# EAGLE design schalterbox_02 (EAGLE 5.12)
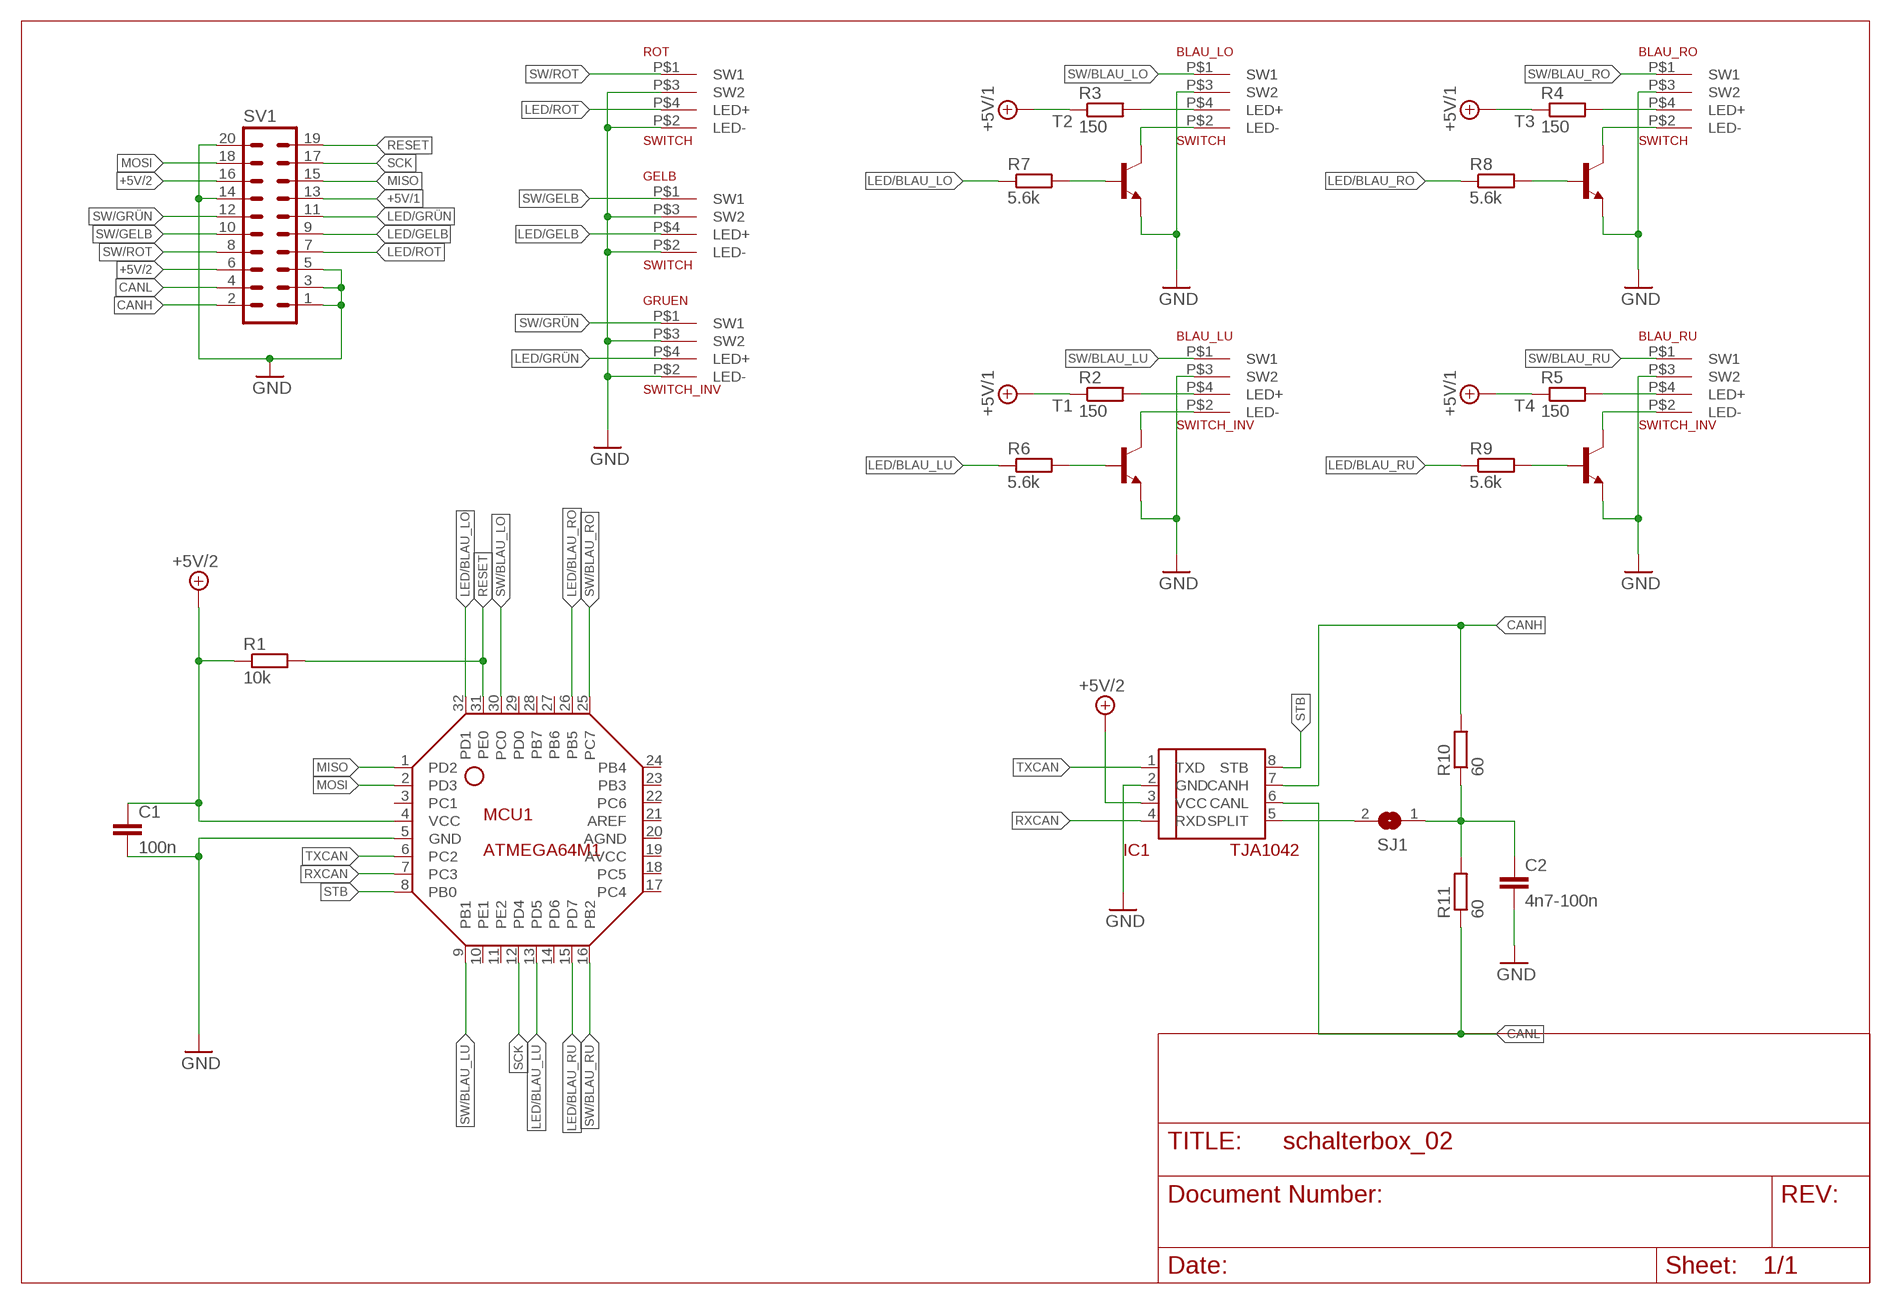
[diagram p0: schematic, sheet 1]

## Parts
BLAU_LO  SWITCH  [SWITCH]
BLAU_LU  SWITCH_INV  [SWITCH_INV]
BLAU_RO  SWITCH  [SWITCH]
BLAU_RU  SWITCH_INV  [SWITCH_INV]
C1  100n  C-EUC0603  [C0603]
C2  4n7-100n  C-EUC0603  [C0603]
GELB  SWITCH  [SWITCH]
GRUEN  SWITCH_INV  [SWITCH_INV]
IC1  TJA1042  [SO08]
MCU1  ATMEGA64M1  [TQFP-32]
R1  10k  R-EU_R0805  [R0805]
R2  150  R-EU_R0805  [R0805]
R3  150  R-EU_R0805  [R0805]
R4  150  R-EU_R0805  [R0805]
R5  150  R-EU_R0805  [R0805]
R6  5.6k  R-EU_R0805  [R0805]
R7  5.6k  R-EU_R0805  [R0805]
R8  5.6k  R-EU_R0805  [R0805]
R9  5.6k  R-EU_R0805  [R0805]
R10  60  R-EU_R0805  [R0805]
R11  60  R-EU_R0805  [R0805]
ROT  SWITCH  [SWITCH]
SJ1  SJ  [SJ]
SV1  ML20L  [ML20L]
T1  BC817-40-NPN-SOT23-BEC  [SOT23-BEC]
T2  BC817-40-NPN-SOT23-BEC  [SOT23-BEC]
T3  BC817-40-NPN-SOT23-BEC  [SOT23-BEC]
T4  BC817-40-NPN-SOT23-BEC  [SOT23-BEC]

## Nets
+5V/1: R2.1 R3.1 R4.1 R5.1 SV1.13
+5V/2: C1.1 IC1.3(VCC) MCU1.4(VCC) R1.1 SV1.6 SV1.16
CANH: IC1.7(CANH) R10.2 SV1.2
CANL: IC1.6(CANL) R11.1 SV1.4
GND: BLAU_LO.P$3(SW2) BLAU_LU.P$3(SW2) BLAU_RO.P$3(SW2) BLAU_RU.P$3(SW2) C1.2 C2.2 GELB.P$2(LED-) GELB.P$3(SW2) GRUEN.P$2(LED-) GRUEN.P$3(SW2) IC1.2(GND) MCU1.5(GND) ROT.P$2(LED-) ROT.P$3(SW2) SV1.1 SV1.3 SV1.5 SV1.14 SV1.20 T1.E T2.E T3.E T4.E
LED/BLAU_LO: MCU1.32(PD1) R7.1
LED/BLAU_LU: MCU1.13(PD5) R6.1
LED/BLAU_RO: MCU1.26(PB5) R8.1
LED/BLAU_RU: MCU1.15(PD7) R9.1
LED/GELB: GELB.P$4(LED+) SV1.9
LED/GRÜN: GRUEN.P$4(LED+) SV1.11
LED/ROT: ROT.P$4(LED+) SV1.7
MISO: MCU1.1(PD2) SV1.15
MOSI: MCU1.2(PD3) SV1.18
N$1: C2.1 R10.1 R11.2 SJ1.1
N$2: IC1.5(SPLIT) SJ1.2
N$3: BLAU_LO.P$4(LED+) R3.2
N$4: BLAU_LO.P$2(LED-) T2.C
N$7: BLAU_LU.P$4(LED+) R2.2
N$8: BLAU_LU.P$2(LED-) T1.C
N$11: BLAU_RU.P$4(LED+) R5.2
N$13: BLAU_RU.P$2(LED-) T4.C
N$17: BLAU_RO.P$4(LED+) R4.2
N$18: BLAU_RO.P$2(LED-) T3.C
N$22: R6.2 T1.B
N$23: R9.2 T4.B
N$24: R8.2 T3.B
N$25: R7.2 T2.B
RESET: MCU1.31(PE0) R1.2 SV1.19
RXCAN: IC1.4(RXD) MCU1.7(PC3)
SCK: MCU1.12(PD4) SV1.17
STB: IC1.8(STB) MCU1.8(PB0)
SW/BLAU_LO: BLAU_LO.P$1(SW1) MCU1.30(PC0)
SW/BLAU_LU: BLAU_LU.P$1(SW1) MCU1.9(PB1)
SW/BLAU_RO: BLAU_RO.P$1(SW1) MCU1.25(PC7)
SW/BLAU_RU: BLAU_RU.P$1(SW1) MCU1.16(PB2)
SW/GELB: GELB.P$1(SW1) SV1.10
SW/GRÜN: GRUEN.P$1(SW1) SV1.12
SW/ROT: ROT.P$1(SW1) SV1.8
TXCAN: IC1.1(TXD) MCU1.6(PC2)
Unconnected: MCU1.3(PC1) MCU1.10(PE1) MCU1.11(PE2) MCU1.14(PD6) MCU1.17(PC4) MCU1.18(PC5) MCU1.19(AVCC) MCU1.20(AGND) MCU1.21(AREF) MCU1.22(PC6) MCU1.23(PB3) MCU1.24(PB4) MCU1.27(PB6) MCU1.28(PB7) MCU1.29(PD0)

## Library data of the parts
BLAU_LO BLAU_RO GELB ROT = ownParts:SWITCH
BLAU_LU BLAU_RU GRUEN = ownParts:SWITCH_INV
C1 C2 = rcl:C-EU: CAPACITOR, European symbol
IC1 = ownParts:TJA1042
MCU1 = ownParts:ATMEGA64M1
R1-R11 = resistor:R-EU_: RESISTOR, European symbol
SJ1 = jumper:SJ: SMD solder JUMPER
SV1 = con-ml:ML20L: HARTING; OC_FARNELL: unknown; OC_NEWARK: unknown
T1-T4 = transistor:*-NPN-: NPN Transistror BF959 corrected 2008.03.06

## Board
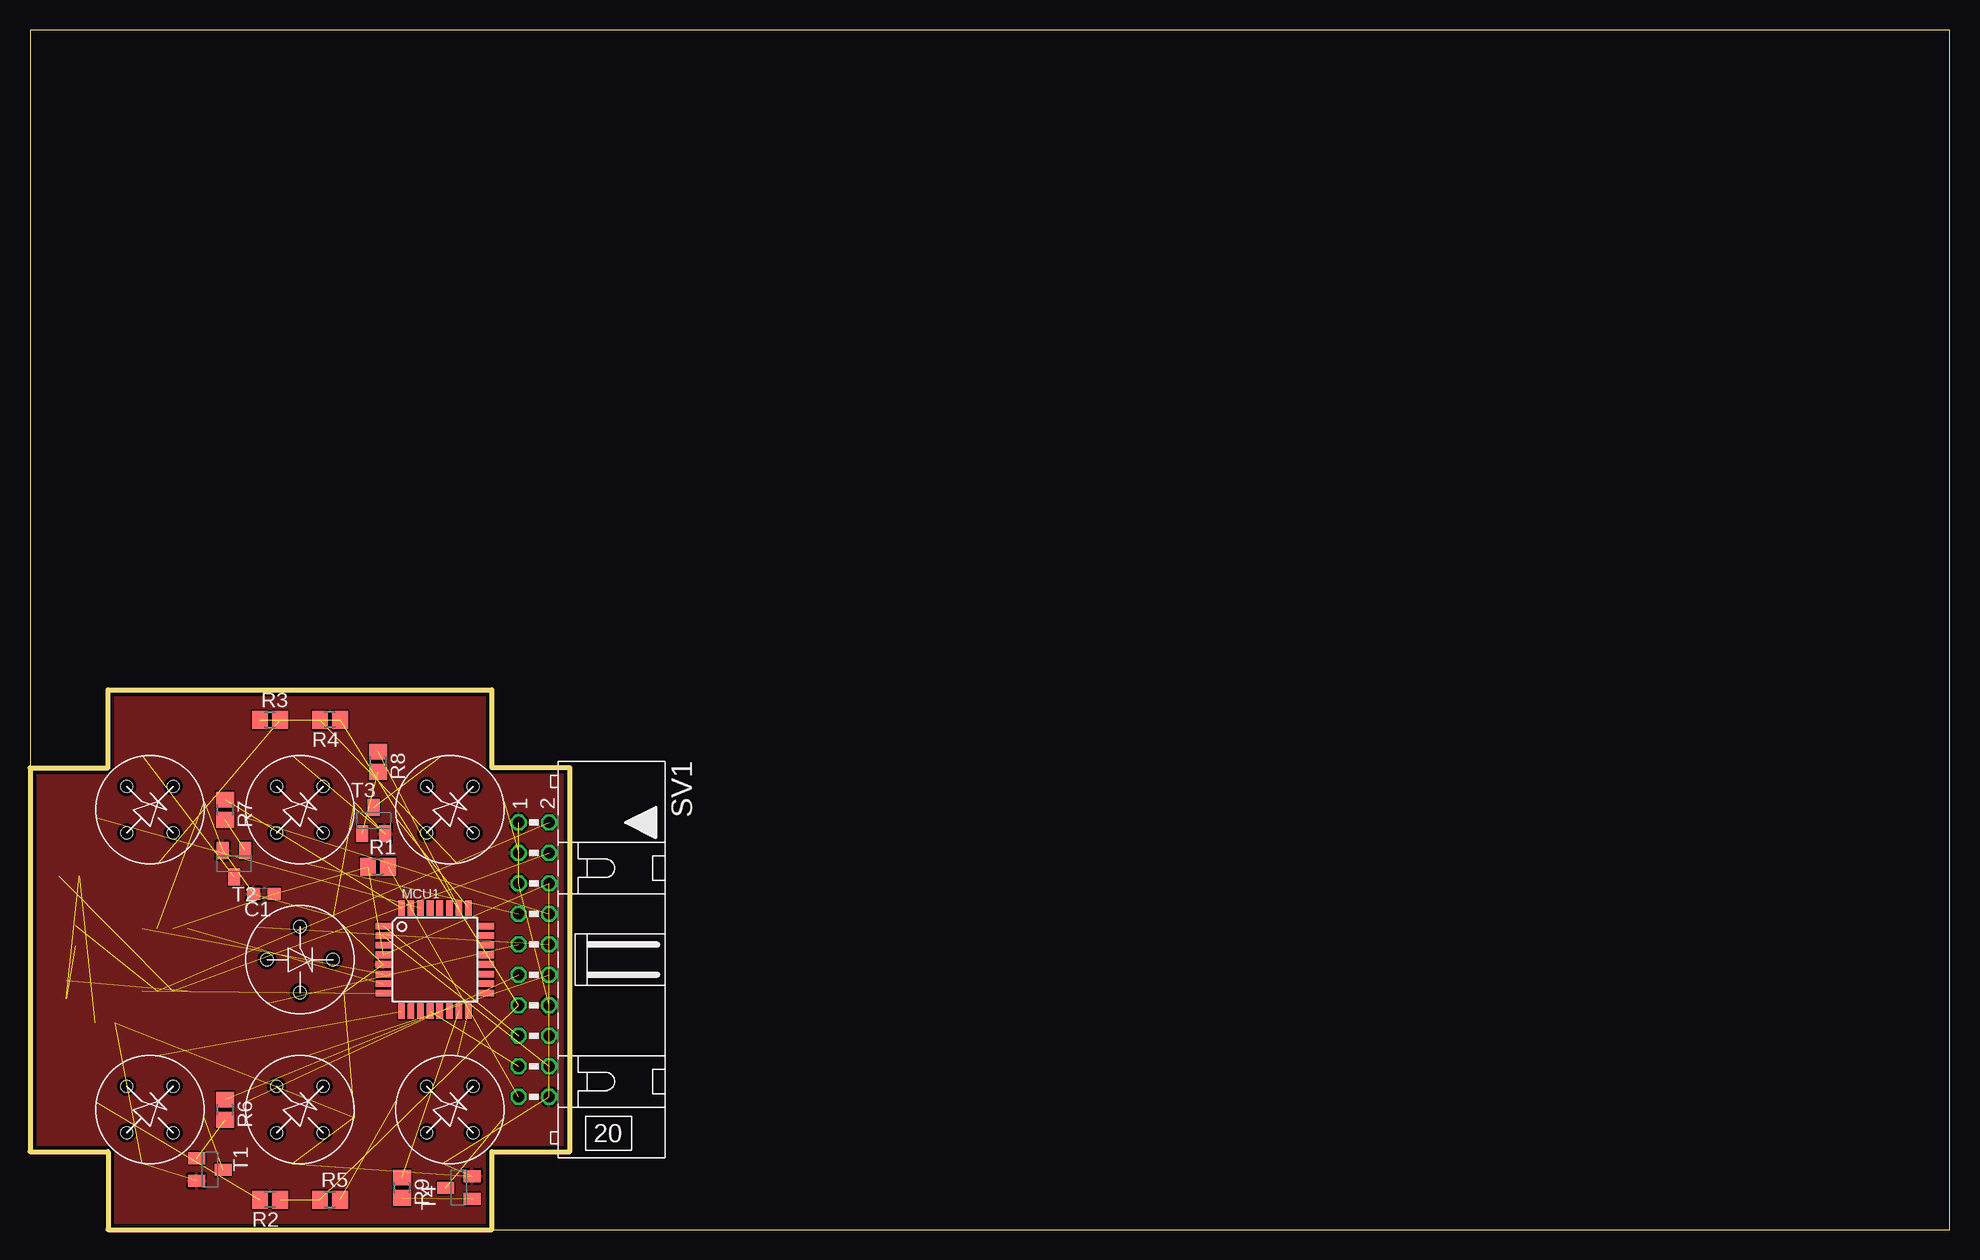
[diagram p1: board, top side]
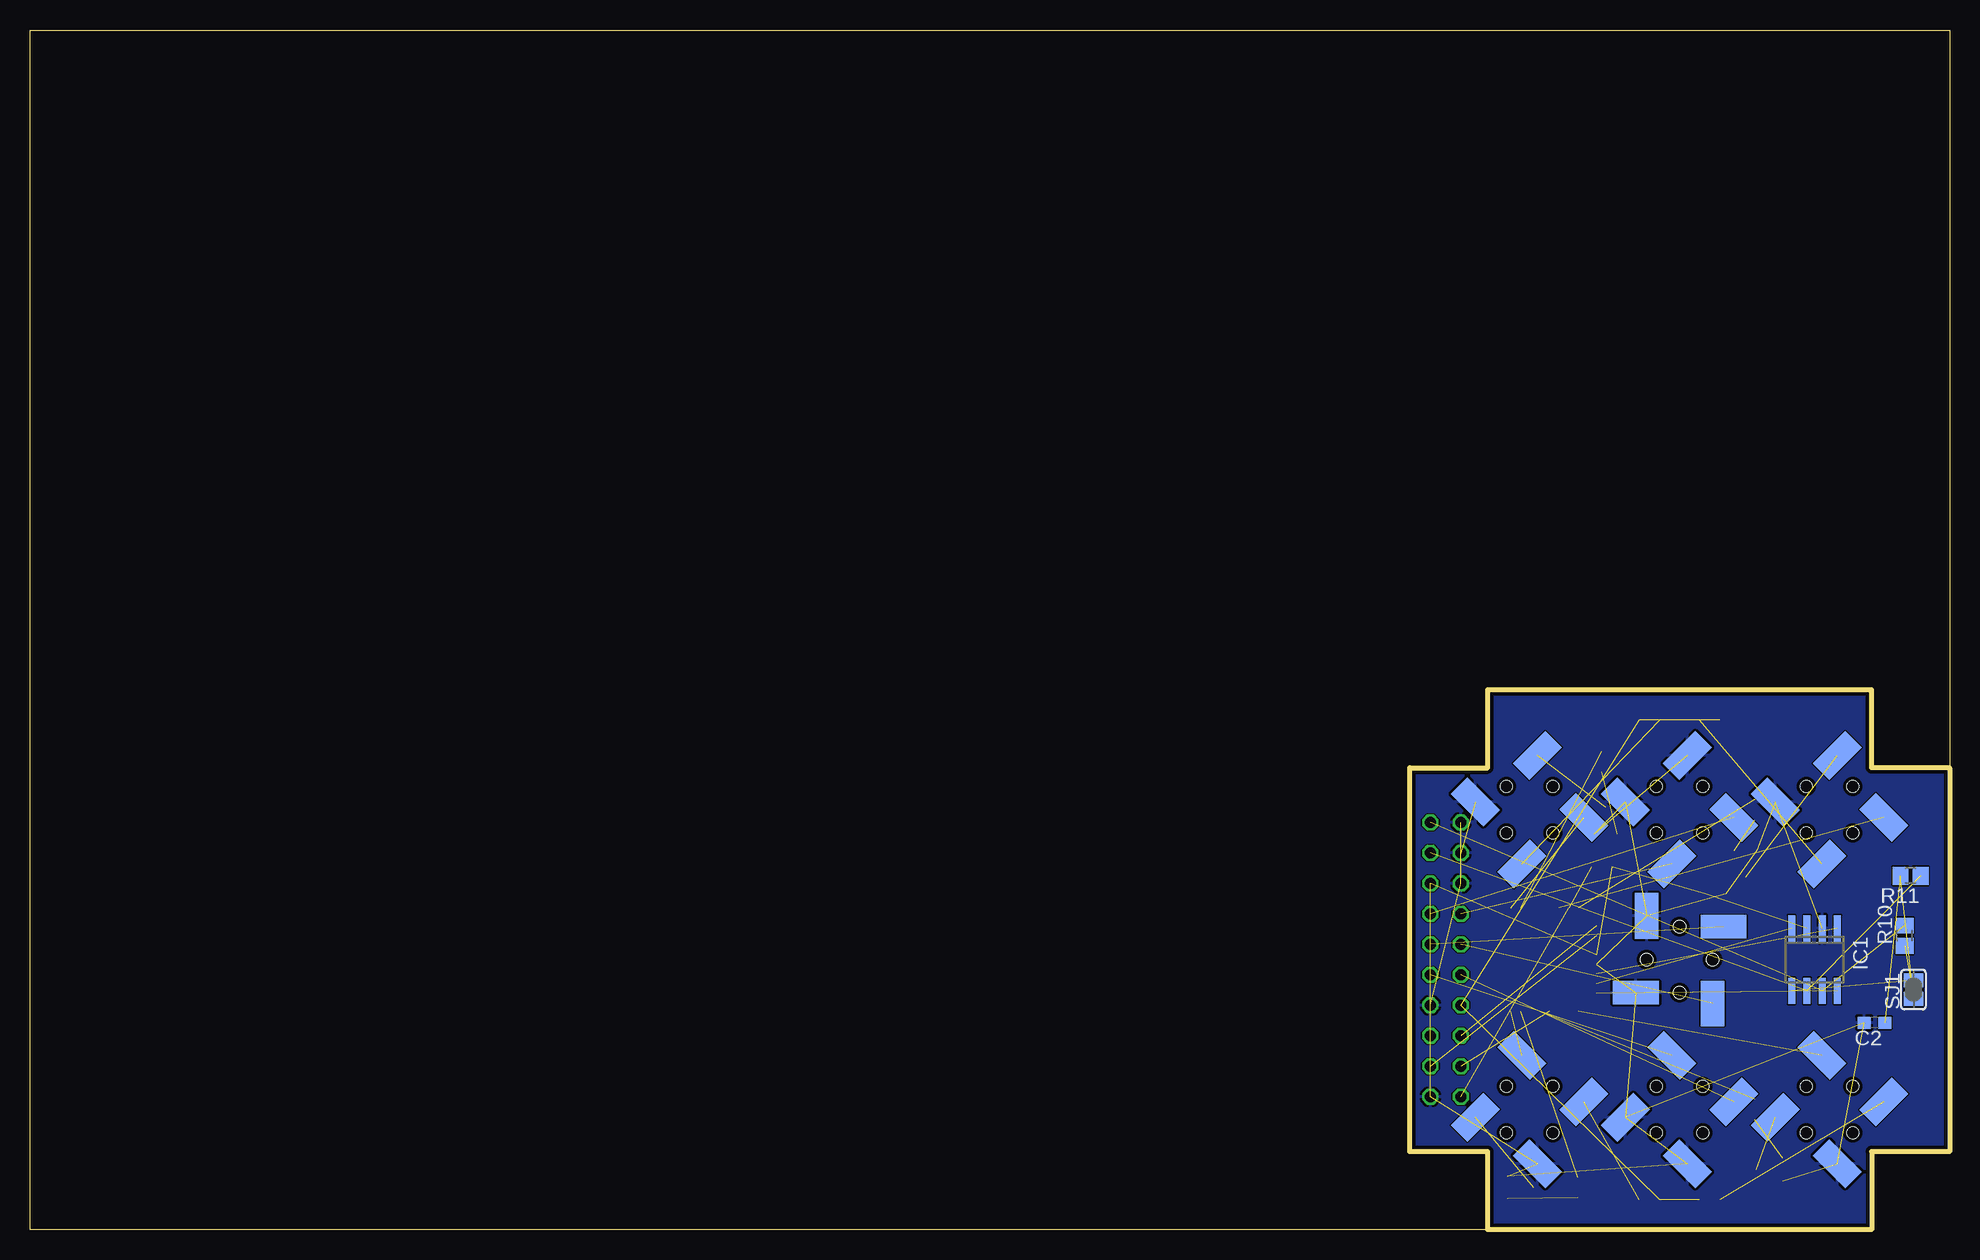
[diagram p2: board, bottom side, seen from below]

Size 160 x 100 mm. Coordinates in mm from the lower left corner, seen from the top.
Outline: 38.5,0 160,0 160,100 0,100 0,38.5
Outline: 0,38.5 0,6.5 6.5,6.5 6.5,0 38.5,0
Outline: 0,38.5 6.5,38.5 6.5,45 38.5,45 38.5,38.5 45,38.5 45,6.5 38.5,6.5 38.5,0
Copper layers (1*16): Top 0.035mm / dielectric 1.5mm / Bottom 0.035mm
Design rules "PCB-POOL HighSpec": minimum track width 0.125mm, minimum drill 0.2mm, track to track 0.125mm, track to pad 0.125mm, pad to pad 0.125mm, via to via 0.125mm, smd to smd 0.125mm, copper to edge 0.3mm, drill to drill 0.2mm, minimum pad ring 0.2mm, minimum via ring 0.125mm, stop-mask expansion 0.075mm, vias tented up to drill 0mil, thermal gap 0.2mm

### Footprints (pad centres in the part's own frame; a part is rotated, then mirrored left to right if it is on the bottom)
SWITCH = smd 3.81 x 1.93 bottom: P$1 -3.655,2.75; P$3 3.655,-2.75 | smd 1.93 x 3.81 bottom: P$2 2.75,3.655; P$4 -2.75,-3.655 | hole 1: -2.75,0; 2.75,0; 0,-2.75; 0,2.75
SWITCH_INV = smd 3.81 x 1.93 bottom: P$1 3.655,2.75; P$3 -3.655,-2.75 | smd 1.93 x 3.81 bottom: P$2 2.75,-3.655; P$4 -2.75,3.655 | hole 1: -2.75,0; 2.75,0; 0,-2.75; 0,2.75
C0603 = smd 1.1 x 1: 1 -0.85,0; 2 0.85,0
SO08 = smd 0.6 x 2.2: 1 -1.905,-2.6; 2 -0.635,-2.6; 3 0.635,-2.6; 4 1.905,-2.6; 5 1.905,2.6; 6 0.635,2.6; 7 -0.635,2.6; 8 -1.905,2.6
TQFP-32 = smd 1.27 x 0.559: 1 -4.293,2.8; 2 -4.293,2; 3 -4.293,1.2; 4 -4.293,0.4; 5 -4.293,-0.4; 6 -4.293,-1.2; 7 -4.293,-2; 8 -4.293,-2.8; 17 4.293,-2.8; 18 4.293,-2; 19 4.293,-1.2; 20 4.293,-0.4; 21 4.293,0.4; 22 4.293,1.2; 23 4.293,2; 24 4.293,2.8 | smd 0.559 x 1.27: 9 -2.8,-4.293; 10 -2,-4.293; 11 -1.2,-4.293; 12 -0.4,-4.293; 13 0.4,-4.293; 14 1.2,-4.293; 15 2,-4.293; 16 2.8,-4.293; 25 2.8,4.293; 26 2,4.293; 27 1.2,4.293; 28 0.4,4.293; 29 -0.4,4.293; 30 -1.2,4.293; 31 -2,4.293; 32 -2.8,4.293
R0805 = smd 1.3 x 1.5: 1 -0.85,0; 2 0.85,0
SJ = smd 1.168 x 1.6: 1 -0.762,0; 2 0.762,0
ML20L = drill 0.914 octagon: 1 -11.43,-1.27; 2 -11.43,1.27; 3 -8.89,-1.27; 4 -8.89,1.27; 5 -6.35,-1.27; 6 -6.35,1.27; 7 -3.81,-1.27; 8 -3.81,1.27; 9 -1.27,-1.27; 10 -1.27,1.27; 11 1.27,-1.27; 12 1.27,1.27; 13 3.81,-1.27; 14 3.81,1.27; 15 6.35,-1.27; 16 6.35,1.27; 17 8.89,-1.27; 18 8.89,1.27; 19 11.43,-1.27; 20 11.43,1.27
SOT23-BEC = smd 1 x 1.4: B -0.95,-1.1; C 0,1.1; E 0.95,-1.1

### Placement (x,y rotation side)
BLAU_LO  10,35 45 top
BLAU_LU  10,10 45 top
BLAU_RO  35,35 45 top
BLAU_RU  35,10 45 top
C1  19.5,28 180 top
C2  6.25,17.25 180 bottom
GELB  22.5,22.5 0 top
GRUEN  22.5,10 45 top
IC1  11.25,22.5 180 bottom
MCU1  33.75,22.5 0 top
R1  29,30.25 0 top
R2  20,2.5 180 top
R3  20,42.5 0 top
R4  25,42.5 180 top
R5  25,2.5 0 top
R6  16.25,10 270 top
R7  16.25,35 270 top
R8  29,39 270 top
R9  31,3.5 270 top
R10  3.75,24.5 90 bottom
R11  3.25,29.5 180 bottom
ROT  22.5,35 45 top
SJ1  3,20 90 bottom
SV1  42,22.5 270 top
T1  15,5 270 top
T2  17,30.5 180 top
T3  28.65,34.1 0 top
T4  35.75,3.5 90 top

### Tracks (layer width: path | path; a pad name or v marks a point on that pad's centre or on a via)
+5V/1  (4 unrouted)
+5V/2  (5 unrouted)
CANH  (2 unrouted)
CANL  (2 unrouted)
GND  (22 unrouted)
  pour Top: 0,45 45,45 45,0 0,0
  pour Bottom: 0,45 45,45 45,0 0,0
LED/BLAU_LO  (1 unrouted)
LED/BLAU_LU  (1 unrouted)
LED/BLAU_RO  (1 unrouted)
LED/BLAU_RU  (1 unrouted)
LED/GELB  (1 unrouted)
LED/GRÜN  (1 unrouted)
LED/ROT  (1 unrouted)
MISO  (1 unrouted)
MOSI  (1 unrouted)
N$1  (3 unrouted)
N$2  (1 unrouted)
N$3  (1 unrouted)
N$4  (1 unrouted)
N$7  (1 unrouted)
N$8  (1 unrouted)
N$11  (1 unrouted)
N$13  (1 unrouted)
N$17  (1 unrouted)
N$18  (1 unrouted)
N$22  (1 unrouted)
N$23  (1 unrouted)
N$24  (1 unrouted)
N$25  (1 unrouted)
RESET  (2 unrouted)
RXCAN  (1 unrouted)
SCK  (1 unrouted)
STB  (1 unrouted)
SW/BLAU_LO  (1 unrouted)
SW/BLAU_LU  (1 unrouted)
SW/BLAU_RO  (1 unrouted)
SW/BLAU_RU  (1 unrouted)
SW/GELB  (1 unrouted)
SW/GRÜN  (1 unrouted)
SW/ROT  (1 unrouted)
TXCAN  (1 unrouted)